# EAGLE board ext_tuner_rev1 (EAGLE 7.6.0)
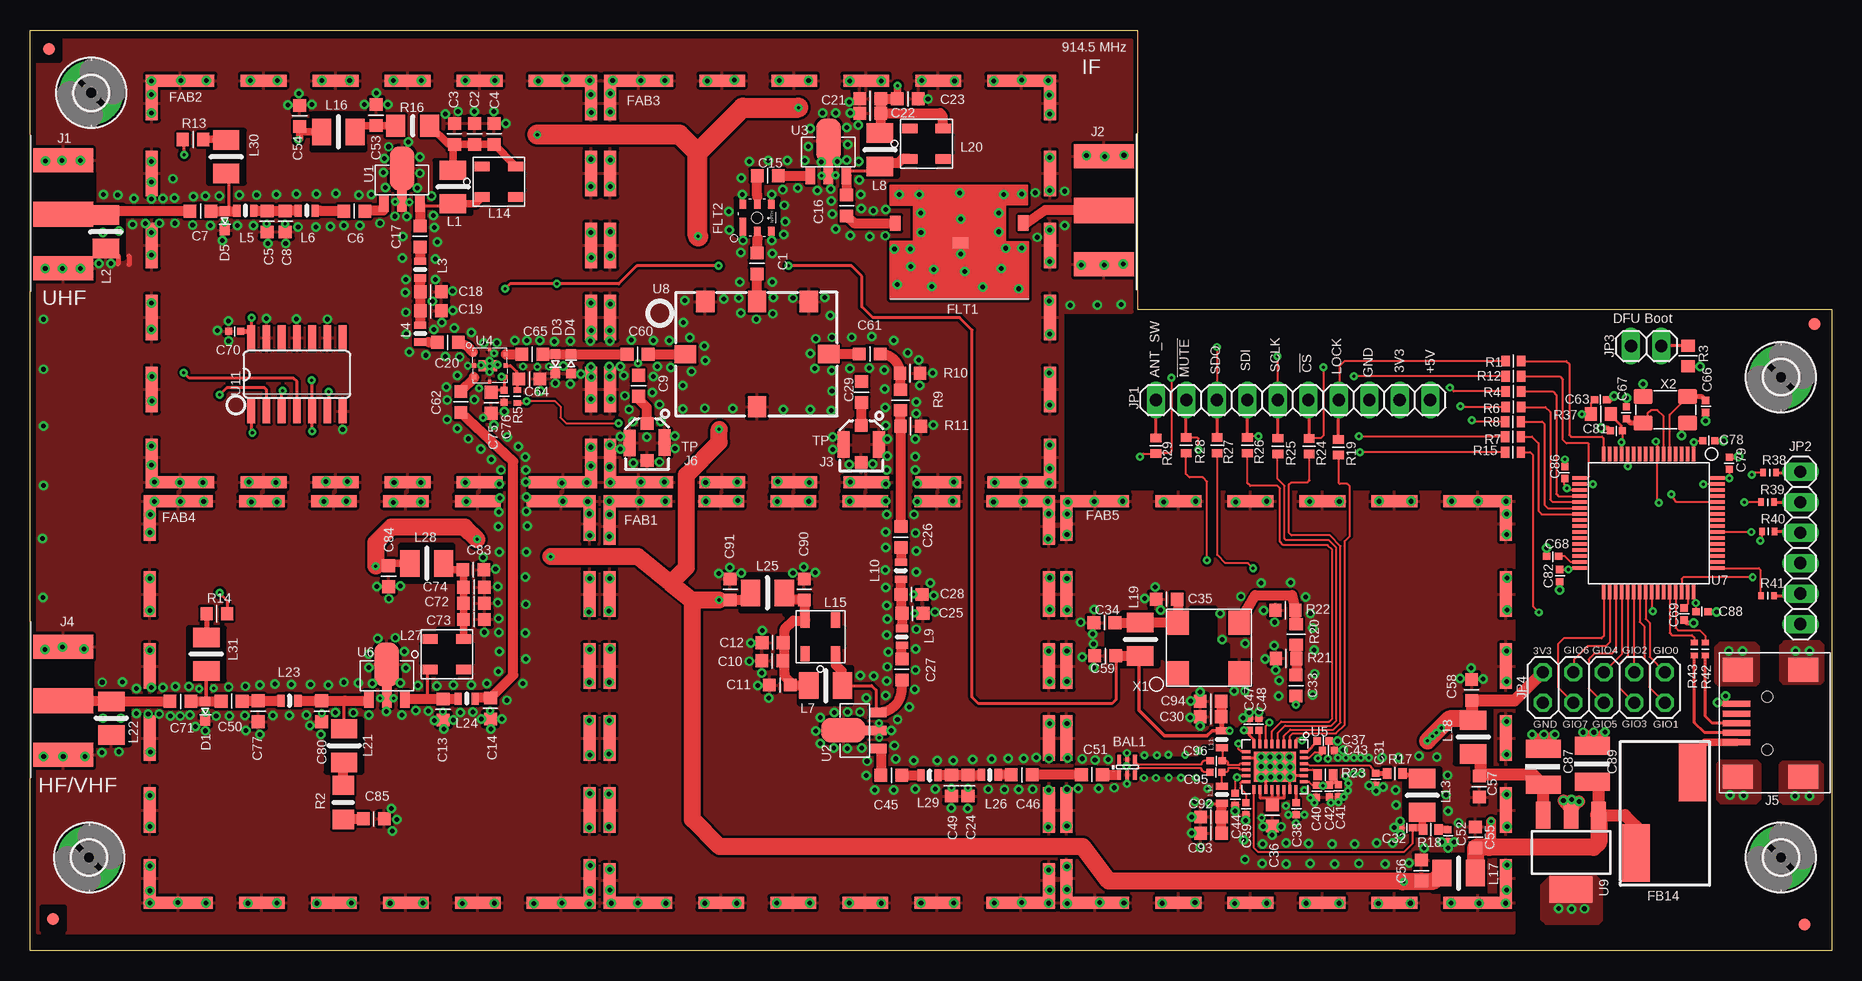
[diagram p8: board, top side]
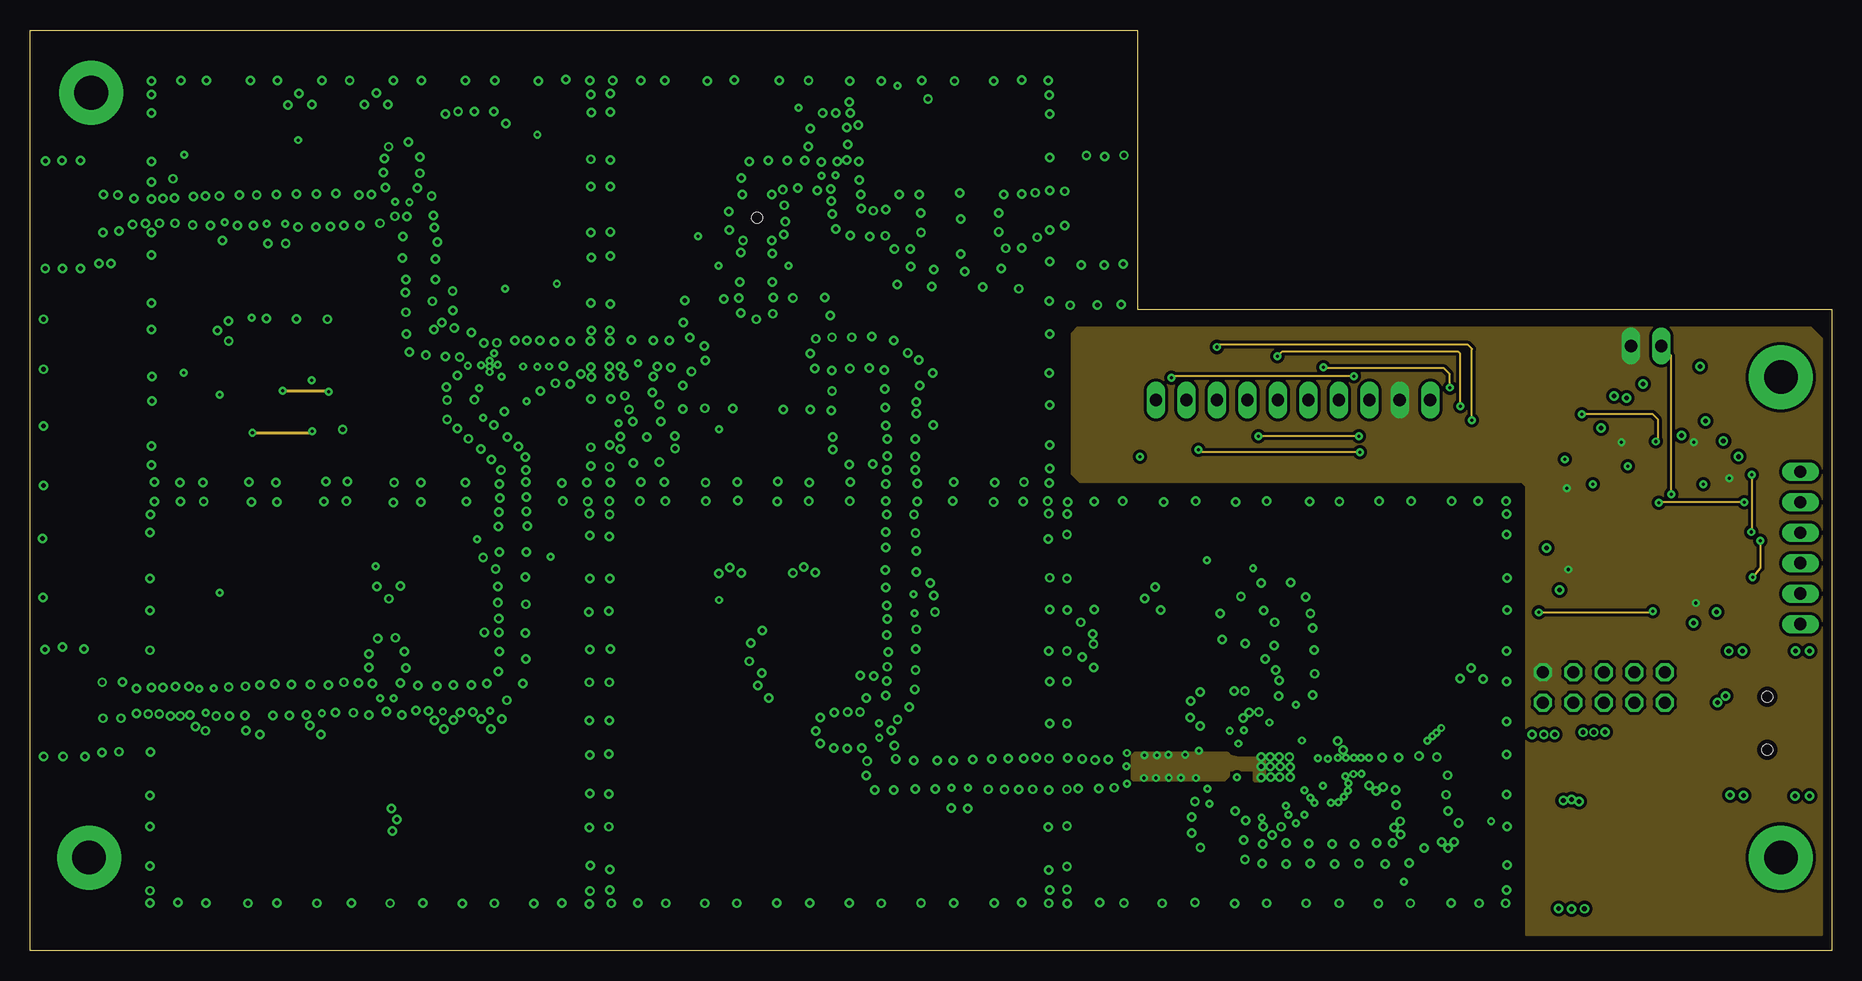
[diagram p9: board, inner layer Route2]
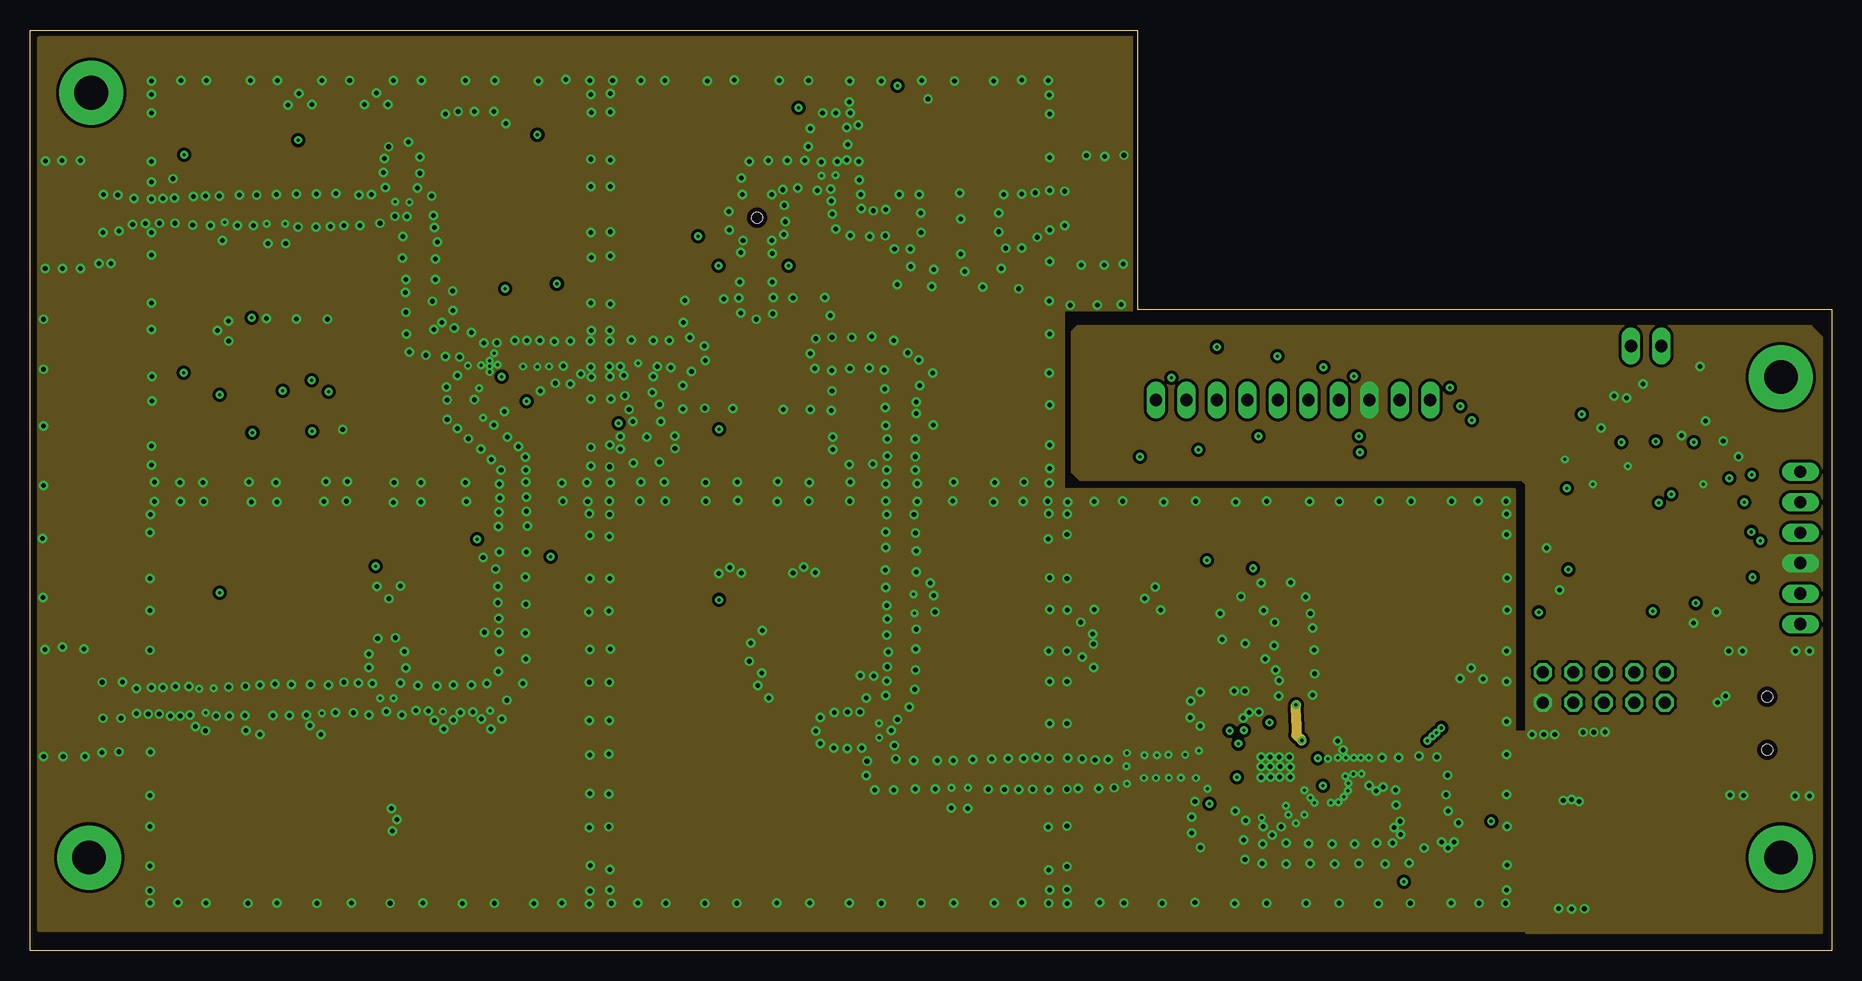
[diagram p10: board, inner layer Route3]
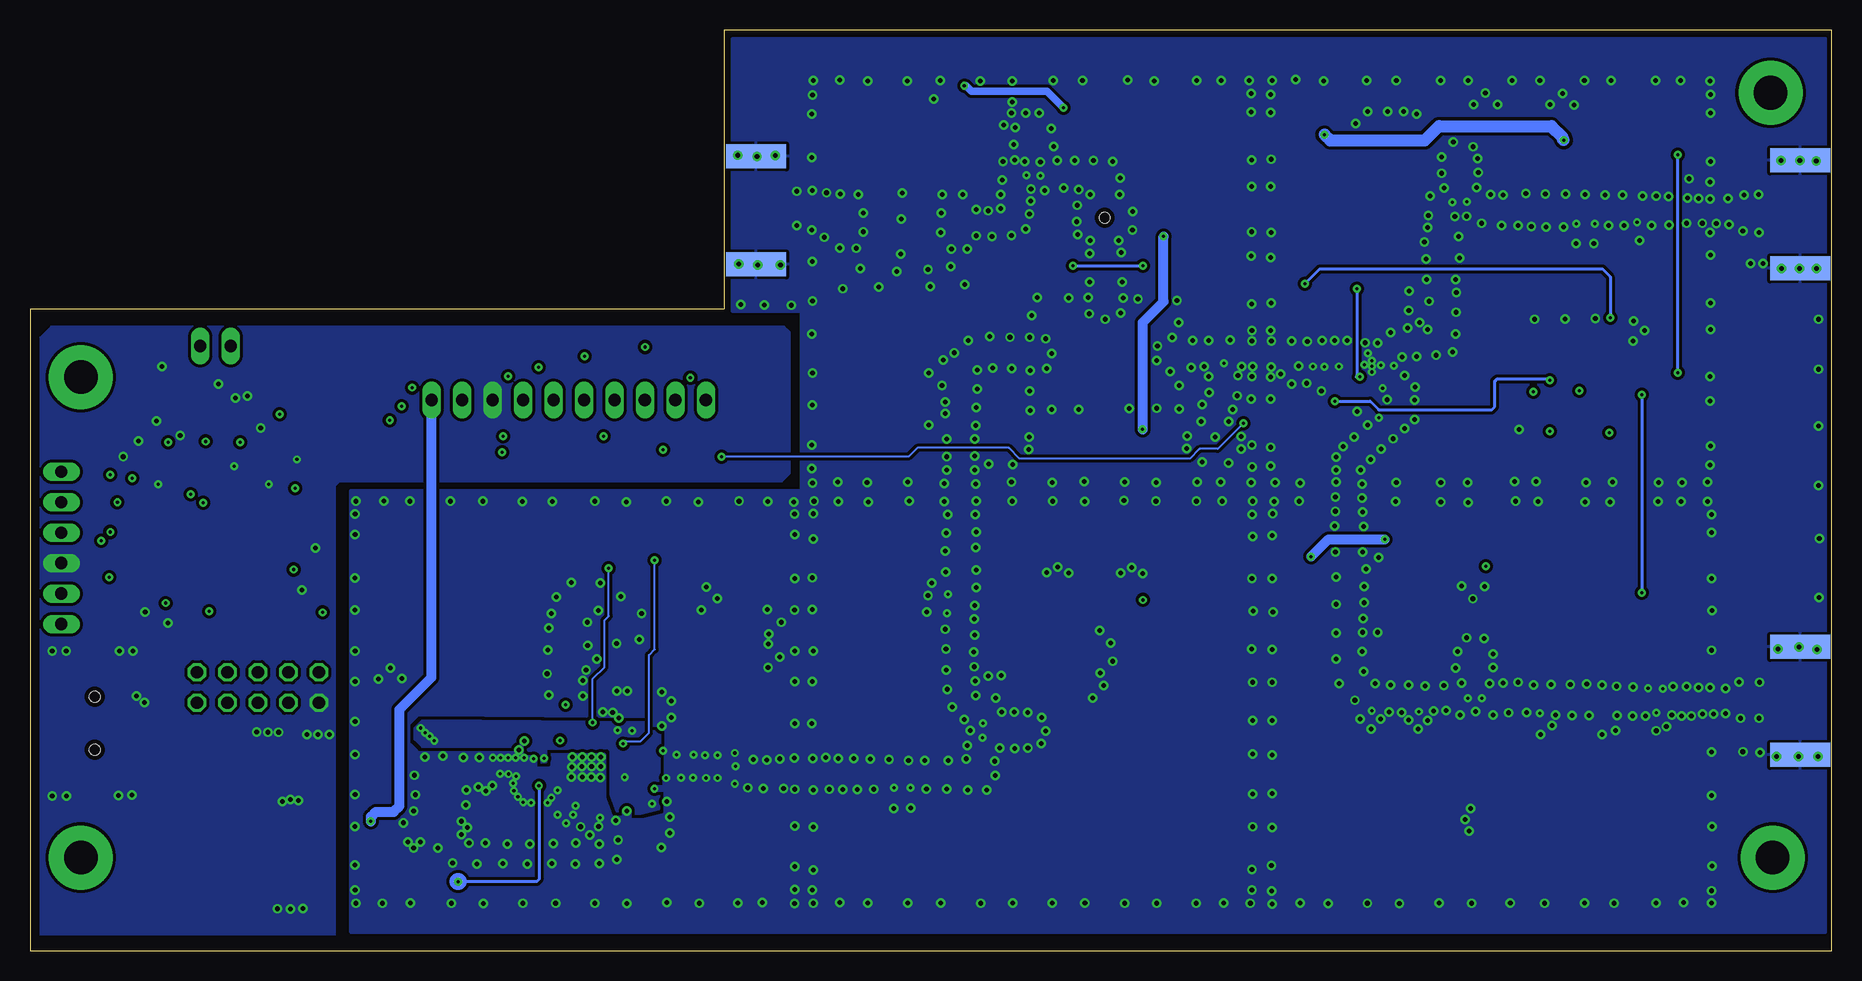
[diagram p11: board, bottom side, seen from below]

Size 150.19 x 76.73 mm. Coordinates in mm from the lower left corner, seen from the top.
Outline: 0,76.73 92.33,76.73 92.33,53.47 150.19,53.47 150.19,0 0,0 0,76.73
Copper layers (1+2+3+16): Top 0.035mm / dielectric 0.2mm / Route2 0.035mm / dielectric 0.15mm / Route3 0.035mm / dielectric 0.2mm / Bottom 0.035mm
Design rules "default *": minimum track width 6mil, minimum drill 10mil, track to track 5mil, track to pad 5mil, pad to pad 5mil, via to via 5mil, smd to smd 0mil, copper to edge 15mil, drill to drill 6mil, minimum pad ring 10mil, minimum via ring 8mil, stop-mask expansion 0mil, vias tented up to drill 50mil, thermal gap 10mil
Net classes: 1 differential: width 0.127 mm, clearance 0.127 mm
Holes 0.89 mm at 60.6,61.09
tRestrict: area 13.9,61.1 to 14.5,62.2; area 26.7,61.1 to 27.3,62.2; area 0.7,57.9 to 5.4,60.2; area 0.6,62.5 to 5.3,64.8; area 0.5,21.9 to 5.2,24.3; area 0.4,17.4 to 5.1,19.7; area 87,62.8 to 91.7,65.2; area 87,58.2 to 91.7,60.6; area 1,1.8 to 2.9,3.6; area 0.6,74.2 to 2.5,76.1; area 147.8,51.3 to 149.7,53.2; area 147,1.3 to 148.9,3.1; 75 more areas

## Footprints (pad centres in the part's own frame; a part is rotated, then mirrored left to right if it is on the bottom)
TDK_BALUN_5PIN = smd 0.3 x 0.8: 1 -0.635,-0.66; 2 0.015,-0.66; 3 0.665,-0.66; 4 0.665,0.64; 5 0.015,0.64; 6 -0.635,0.64
C0603 = smd 1.05 x 1.08: 1 -0.875,0; 2 0.875,0
C0402@1 = smd 0.6 x 0.6: 1 -0.5,0; 2 0.501,0
1210K = smd 1.5 x 2.9: A -1.5,0; C 1.5,0
SC-79_PINDIODE = smd 0.813 x 0.813: A -0.813,-0.025; C 0.787,-0.025
RF_SHIELD = smd 5.72 x 1: P$1 -15.56,-16.51; P$6 16.36,-16.51; P$7 -15.56,16.97; P$12 16.36,16.97 | smd 3.8 x 1: P$2 -8.59,-16.51; P$3 -2.59,-16.51; P$4 3.41,-16.51; P$5 9.41,-16.51; P$8 -8.59,16.97; P$9 -2.59,16.97; P$10 3.41,16.97; P$11 9.41,16.97 | smd 1 x 3.14: P$13 -17.92,-14.44; P$19 18.72,-14.44 | smd 1 x 3.8: P$14 -17.92,-8.77; P$15 -17.92,-2.77; P$16 -17.92,3.23; P$17 -17.92,9.23; P$20 18.72,-8.77; P$21 18.72,-2.77; P$22 18.72,3.23; P$23 18.72,9.23 | smd 1 x 2.8: P$18 -17.92,15.07; P$24 18.72,15.07
SMB2.5-2 = smd 4.8 x 2.3: P$1 -3.364,2.416; P$2 3.336,-2.284
FIDUCIAL = smd 1.016 x 1.016: 1 0,0
SAWMURATA914 = smd 0.889 x 1.27: 1 5.283,1.295; 2 -5.385,1.27 | smd 1.27 x 0.889: GPAD 0.051,-0.356
SM3030-6 = smd 1.5 x 0.6: 1 -0.725,1.175 | smd 0.75 x 0.6: 2 -1.1,-0.025; 3 -1.1,-1.2; 4 1.15,-1.2; 5 1.15,-0.025; 6 1.15,1.175
2,8-PAD = drill 2.8 pad 5.334: B2,8 0,0
SMA_EDGE = smd 2 x 5: GND1 0,0; GND3 9,0 | smd 2 x 5 bottom: GND2 0,0.127; GND4 9,0.127 | smd 2.1 x 5: RF 4.5,0
UFLCONNECTOR = smd 2.2 x 1: 1 0.01,-1.46; 2 -0.01,1.46 | smd 1.05 x 1.05: 3 -1.5,0; RF 1.6,0
1734035-2 = smd 2.3 x 0.5: 1 2.9,1.45; 2 2.9,0.65; 3 2.9,-0.15; 4 2.9,-0.95; 5 2.9,-1.75 | smd 2.5 x 2: 6 -2.65,-4.6; 7 -2.65,4.3; 8 2.8,-4.6; 9 2.8,4.3 | hole 0.9: 0.35,2.05; 0.35,-2.35
1X10 = drill 1.016 long: 1 -11.43,0; 2 -8.89,0; 3 -6.35,0; 4 -3.81,0; 5 -1.27,0; 6 1.27,0; 7 3.81,0; 8 6.35,0; 9 8.89,0; 10 11.43,0
1X06 = drill 1.016 long: 1 -6.35,0; 2 -3.81,0; 3 -1.27,0; 4 1.27,0; 5 3.81,0; 6 6.35,0
1X02 = drill 1.016 long: 1 -1.27,0; 2 1.27,0
2X05 = drill 1.016 octagon: 1 -5.08,-1.27; 2 -5.08,1.27; 3 -2.54,-1.27; 4 -2.54,1.27; 5 0,-1.27; 6 0,1.27; 7 2.54,-1.27; 8 2.54,1.27; 9 5.08,-1.27; 10 5.08,1.27
L3225M = smd 1.6 x 2.2: 1 -1.4,0; 2 1.4,0
MURATA_LQW_0603 = smd 0.6 x 1: 1 -0.7,0; 2 0.7,0
TCCH-80+ = smd 0.762 x 1.27: 1 -1.27,1.524; 2 1.27,1.524; 3 1.27,-1.27; 4 -1.27,-1.27
R0603_COMPACT = smd 0.7 x 0.9: 1 -0.65,0; 2 0.65,0
R1206 = smd 1.6 x 1.803: 1 -1.422,0; 2 1.422,0
R0603 = smd 1 x 1.1: 1 -0.85,0; 2 0.85,0
0402$1 = smd 0.457 x 0.61: 1 -0.548,0; 2 0.523,0
0603 = smd 1 x 1.1: 1 -0.85,0; 2 0.85,0
R0402 = smd 0.7 x 0.9: 1 -0.65,0; 2 0.65,0
SOT89 = smd 0.8 x 1.4: 1 -1.474,-2.768; 3 1.524,-2.768 | smd 0.8 x 1.9: 2 0.025,-2.514 | smd 2.032 x 3.65: 2@1 0.025,0.153
PE4245 = smd 0.355 x 0.355: 1 -0.95,-1.325; 2 0,-1.325; 3 0.95,-1.325; 4 0.95,1.325; 5 0,1.325; 6 -0.95,1.325 | smd 0.3 x 0.25: G2 1.35,0; G3 -1.35,0 | smd 0.92 x 1.54: GP 0.002,-0.175
QFN28_NONSQ = smd 0.25 x 0.7: 1 -1.75,-1.9; 2 -1.25,-1.9; 3 -0.75,-1.9; 4 -0.25,-1.9; 5 0.25,-1.9; 6 0.75,-1.9; 7 1.25,-1.9; 8 1.75,-1.9; 15 1.75,1.9; 16 1.25,1.9; 17 0.75,1.9; 18 0.25,1.9; 19 -0.25,1.9; 20 -0.75,1.9; 21 -1.25,1.9; 22 -1.75,1.9 | smd 0.7 x 0.25: 9 2.4,-1.25; 10 2.4,-0.75; 11 2.4,-0.25; 12 2.4,0.25; 13 2.4,0.75; 14 2.4,1.25; 23 -2.4,1.25; 24 -2.4,0.75; 25 -2.4,0.25; 26 -2.4,-0.25; 27 -2.4,-0.75; 28 -2.4,-1.25 | smd 3.5 x 2.5: GPAD 0,0
STM32_LQFP64 = smd 0.3 x 1.2: 1 -3.5,-5.5; 2 -3,-5.5; 3 -2.5,-5.5; 4 -2,-5.5; 5 -1.5,-5.5; 6 -1,-5.5; 7 -0.5,-5.5; 8 0,-5.5; 9 0.5,-5.5; 10 1,-5.5; 11 1.5,-5.5; 12 2,-5.5; 13 2.5,-5.5; 14 3,-5.5; 15 3.5,-5.5; 16 4,-5.5; 33 4,6; 34 3.5,6; 35 3,6; 36 2.5,6; 37 2,6; 38 1.5,6; 39 1,6; 40 0.5,6; 41 0,6; 42 -0.5,6; 43 -1,6; 44 -1.5,6; 45 -2,6; 46 -2.5,6; 47 -3,6; 48 -3.5,6 | smd 1.2 x 0.3: 17 6,-3.5; 18 6,-3; 19 6,-2.5; 20 6,-2; 21 6,-1.5; 22 6,-1; 23 6,-0.5; 24 6,0; 25 6,0.5; 26 6,1; 27 6,1.5; 28 6,2; 29 6,2.5; 30 6,3; 31 6,3.5; 32 6,4; 49 -5.5,4; 50 -5.5,3.5; 51 -5.5,3; 52 -5.5,2.5; 53 -5.5,2; 54 -5.5,1.5; 55 -5.5,1; 56 -5.5,0.5; 57 -5.5,0; 58 -5.5,-0.5; 59 -5.5,-1; 60 -5.5,-1.5; 61 -5.5,-2; 62 -5.5,-2.5; 63 -5.5,-3; 64 -5.5,-3.5
SYM-18H = smd 1.778 x 1.524: 1 5.969,0.025; 2 -5.969,0 | smd 1.524 x 1.778: 3 0,-4.369; 4 0,4.394; 5 -4.318,-4.369; 6 4.318,-4.369
SOT223 = smd 1.219 x 2.235: 1 -2.311,-3.099; 2 0,-3.099; 3 2.311,-3.099 | smd 3.6 x 2.2: 4 0,3.099
SO14 = smd 0.66 x 2.032: 1 -3.81,-3.073; 2 -2.54,-3.073; 3 -1.27,-3.073; 4 0,-3.073; 5 1.27,-3.073; 6 2.54,-3.073; 7 3.81,-3.073; 8 3.81,3.073; 9 2.54,3.073; 10 1.27,3.073; 11 0,3.073; 12 -1.27,3.073; 13 -2.54,3.073; 14 -3.81,3.073
CWX8XX_5MM_7MM = smd 1.8 x 2: 1 -2.5,-2.1; 2 2.58,-2.1; 3 2.58,2.1; 4 -2.5,2.1
ECS_CRYSTAL_ECS-250-20-30B-DU_CRYSTAL = smd 1.6 x 1.25: 1 -1.9,-1.1; 3 1.8,1.1; GND@1 -1.9,1.1; GND@2 1.8,-1.1

## Placement (x,y rotation side)
BAL1  HHM17147A1  [TDK_BALUN_5PIN]  91.44,15.32 0 top
C1  330pF  [C0603]  60.6,57.28 90 top
C2  1000pF  [C0603]  37.06,68.07 270 top
C3  330pF  [C0603]  35.38,68.07 270 top
C4  2.2uF  [C0603]  38.68,68.07 90 top
C5  2.2pF  [C0603]  19.76,60.78 270 top
C6  4.7pF  [C0603]  27.03,61.65 180 top
C7  4.7pF  [C0603]  14.22,61.65 180 top
C8  1.0pF  [C0603]  21.29,60.78 270 top
C9  DNP  [C0603]  50.72,47.09 90 top
C10  1000pF  [C0603]  61.87,24.16 0 top
C11  330pF  [C0603]  62.51,22.15 0 top
C12  2.2uF  [C0603]  61.9,25.68 180 top
C13  2.2pF  [C0603]  34.44,20.12 270 top
C14  8.2pF  [C0603]  38.38,20.19 270 top
C15  330pF  [C0603]  61.49,64.59 0 top
C16  330pF  [C0603]  68.07,62.1 90 top
C17  4.7pF  [C0603]  32.51,59.54 90 top
C18  2.2pF  [C0603]  33.4,54.91 0 top
C19  1.0pF  [C0603]  33.4,53.34 0 top
C20  4.7pF  [C0603]  34.82,50.7 180 top
C21  1000pF  [C0603]  70.03,71.02 0 top
C22  330pF  [C0603]  70.03,69.8 0 top
C23  2.2uF  [C0603]  73.18,70.99 0 top
C24  1.0pF  [C0603]  78.18,13.77 270 top
C25  1.0pF  [C0603]  73.56,28.12 0 top
C26  2.2pF  [C0603]  72.59,34.47 270 top
C27  2.2pF  [C0603]  72.67,23.44 270 top
C28  0.5pF  [C0603]  73.48,29.69 0 top
C29  DNP  [C0603]  69.32,46.56 90 top
C30  1uF  [C0603]  98.42,19.51 180 top
C31  1.5nF  [C0402@1]  112.17,14.3 270 top
C32  2.2nF  [C0402@1]  114.76,10.26 180 top
C33  1uF  [C0603]  105.54,22.1 90 top
C34  330pF  [C0603]  89.56,27.36 0 top
C35  1uF  [C0603]  94.74,29.31 180 top
C36  2.2uF  [C0603]  103.56,11.28 270 top
C37  1uF  [C0402@1]  107.8,17.48 0 top
C38  1uF  [C0402@1]  105.54,11.84 270 top
C39  1uF  [C0402@1]  101.35,11.84 270 top
C40  0.012uF  [C0402@1]  107.24,13.28 270 top
C41  0.012uF  [C0402@1]  109.07,13.34 270 top
C42  1uF  [C0402@1]  108.31,13.31 270 top
C43  0.1uF  [C0402@1]  108.23,16.69 0 top
C44  0.012uF  [C0402@1]  100.46,12.62 270 top
C45  2.2pF  [C0603]  71.81,14.63 0 top
C46  2.2pF  [C0603]  82.68,14.66 0 top
C47  0.1uF  [C0402@1]  101.63,18.87 90 top
C48  0.1uF  [C0402@1]  102.44,18.87 90 top
C49  0.5pF  [C0603]  76.81,13.77 270 top
C50  1uF  [C0603]  16.81,20.8 180 top
C51  330pF  [C0603]  88.52,14.68 0 top
C52  56nF  [C0402@1]  118.19,9.58 270 top
C53  2.2uF  [C0603]  28.85,69.65 90 top
C54  2.2uF  [C0603]  22.48,69.57 90 top
C55  2.2uF  [C0603]  120.5,9.45 90 top
C56  2.2uF  [C0603]  115.98,6.68 90 top
C57  2.2uF  [C0603]  120.8,13.69 270 top
C58  2.2uF  [C0603]  120.17,21.74 90 top
C59  2.2uF  [C0603]  89.64,24.59 180 top
C60  1uF  [C0603]  50.65,49.71 0 top
C61  1uF  [C0603]  70,49.73 0 top
C62  1000pF  [C0603]  35.92,45.75 270 top
C63  1uF  [C0402@1]  130.91,45.92 0 top
C64  330pF  [C0603]  41.63,47.65 0 top
C65  1000pF  [C0603]  41.86,49.71 180 top
C66  18pF  [C0402@1]  139.67,45.36 270 top
C67  18pF  [C0402@1]  133.07,44.83 90 top
C68  1uF  [C0402@1]  126.92,32.87 180 top
C69  1uF  [C0402@1]  137.87,28.07 270 top
C70  0.1uF  [C0402@1]  17.07,51.64 180 top
C71  1uF  [C0603]  12.55,20.78 180 top
C72  1000pF  [C0603]  37.01,28.96 180 top
C73  330pF  [C0603]  37.01,27.61 180 top
C74  2.2uF  [C0603]  37.01,30.3 0 top
C75  330pF  [C0603]  38.46,45.67 270 top
C76  0.1uF  [C0402@1]  39.52,46.2 270 top
C77  2.2pF  [C0603]  19.02,19.96 270 top
C78  0.1uF  [C0402@1]  139.93,42.49 0 top
C79  0.1uF  [C0402@1]  141.66,40.64 90 top
C80  8.2pF  [C0603]  24.31,19.96 270 top
C81  0.1uF  [C0402@1]  132.23,43.33 180 top
C82  0.1uF  [C0402@1]  127.51,31.27 270 top
C83  2.2uF  [C0603]  36.96,31.75 0 top
C84  2.2uF  [C0603]  29.9,31.22 270 top
C85  330pF  [C0603]  28.65,11 180 top
C86  0.1uF  [C0402@1]  127.94,39.85 90 top
C87  GRM32EC70J107ME15L 100uF  [1210K]  126.14,15.34 90 top
C88  0.1uF  [C0402@1]  139.37,28.24 0 top
C89  GRM32EC70J107ME15L 100uF  [1210K]  130.23,15.57 90 top
C90  2.2uF  [C0603]  64.54,30.12 90 top
C91  2.2uF  [C0603]  58.37,30.12 90 top
C92  1uF  [C0603]  98.45,11.15 180 top
C93  330pF  [C0603]  98.45,9.8 180 top
C94  330pF  [C0603]  98.42,20.8 180 top
C95  18pF  [C0402@1]  98.86,14.88 180 top
C96  18pF  [C0402@1]  98.88,15.85 180 top
D1  SMP1321-079LFSMD  [SC-79_PINDIODE]  14.63,19.96 270 top
D3  SMP1321-079LFSMD  [SC-79_PINDIODE]  43.81,48.92 270 top
D4  SMP1321-079LFSMD  [SC-79_PINDIODE]  45.09,48.92 90 top
D5  SMP1321-079LFSMD  [SC-79_PINDIODE]  16.26,60.83 270 top
FAB1  2118724  [RF_SHIELD]  67.03,20.95 180 top
FAB2  2118724  [RF_SHIELD]  28.07,55.55 0 top
FAB3  2118724  [RF_SHIELD]  66.29,55.55 0 top
FAB4  2118724  [RF_SHIELD]  27.91,20.5 0 top
FAB5  2118724  [RF_SHIELD]  104.32,20.5 0 top
FB14  SMB2.5R-2  [SMB2.5-2]  136.3,11.51 90 top
FID1  FIDUCIALSMD  [FIDUCIAL]  1.57,75.16 0 top
FID2  FIDUCIALSMD  [FIDUCIAL]  148.74,52.25 0 top
FID3  FIDUCIALSMD  [FIDUCIAL]  1.93,2.67 0 top
FID4  FIDUCIALSMD  [FIDUCIAL]  147.93,2.21 0 top
FLT1  DFCB3914MLEJAA-RF1**DE-W0  [SAWMURATA914]  77.52,59.36 0 top
FLT2  B39921B3588U410  [SM3030-6]  60.6,61.06 90 top
H1  3.2mm  [2,8-PAD]  145.95,47.8 0 top
H2  3.2mm  [2,8-PAD]  145.95,7.77 0 top
H3  3.2mm  [2,8-PAD]  5.11,71.5 0 top
H4  3.2mm  [2,8-PAD]  4.93,7.77 0 top
J1  SMA0.062  [SMA_EDGE]  2.77,56.87 90 top
J2  SMA0.062  [SMA_EDGE]  89.53,66.19 270 top
J3  AMPHENOL_A-1JB  [UFLCONNECTOR]  69.29,42.19 90 top
J4  SMA0.062  [SMA_EDGE]  2.77,16.33 90 top
J5  1734035-2  [1734035-2]  145.16,18.82 180 top
J6  AMPHENOL_A-1JB  [UFLCONNECTOR]  51.43,42.34 90 top
JP1  [1X10]  105.28,45.9 180 top
JP2  [1X06]  147.57,33.58 90 top
JP3  [1X02]  134.72,50.39 0 top
JP4  [2X05]  131.19,21.95 0 top
L1  47nH  [L3225M]  35.26,63.65 270 top
L2  120nH  [L3225M]  6.32,59.92 270 top
L3  LQW18AN17NG8ZD 17nH  [MURATA_LQW_0603]  32.51,56.77 270 top
L4  LQW18AN17NG8ZD 17nH  [MURATA_LQW_0603]  32.54,51.44 270 top
L5  LQW18AN17NG8ZD 17nH  [MURATA_LQW_0603]  17.96,61.67 0 top
L6  LQW18AN17NG8ZD 17nH  [MURATA_LQW_0603]  23.06,61.67 0 top
L7  47nH  [L3225M]  66.32,22.1 0 top
L8  47nH  [L3225M]  70.84,66.75 270 top
L9  LQW18AN10NG10D 10nH  [MURATA_LQW_0603]  72.67,26.16 90 top
L10  LQW18AN10NG10D 10nH  [MURATA_LQW_0603]  72.59,31.67 90 top
L11  LQW18AN68NJ00D 68nH  [MURATA_LQW_0603]  99.34,17.63 90 top
L12  LQW18AN68NJ00D 68nH  [MURATA_LQW_0603]  99.34,13 270 top
L13  LQW32FT100M0HL 10uH  [L3225M]  116.05,12.95 270 top
L14  TCCH-80+  [TCCH-80+]  39.22,64.08 90 top
L15  TCCH-80+  [TCCH-80+]  65.89,26.29 180 top
L16  CBC3225T4R7MR 4.7uH  [L3225M]  25.7,68.25 0 top
L17  CBC3225T4R7MR 4.7uH  [L3225M]  119.08,6.48 0 top
L18  CBC3225T4R7MR 4.7uH  [L3225M]  120.29,17.81 270 top
L19  CBC3225T4R7MR 4.7uH  [L3225M]  92.56,25.96 90 top
L20  TCCH-80+  [TCCH-80+]  74.85,67.26 90 top
L21  620nH  [L3225M]  26.19,17.09 90 top
L22  620nH  [L3225M]  6.78,19.38 90 top
L23  LQW18AN15NJ10D 15nH  [MURATA_LQW_0603]  21.64,20.83 0 top
L24  LQW18AN15NJ10D 15nH  [MURATA_LQW_0603]  36.4,21.01 0 top
L25  CBC3225T4R7MR 4.7uH  [L3225M]  61.47,29.82 0 top
L26  LQW18AN10NG10D 10nH  [MURATA_LQW_0603]  80.01,14.66 180 top
L27  TCCH-80+  [TCCH-80+]  34.87,24.71 90 top
L28  CBC3225T4R7MR 4.7uH  [L3225M]  33.07,32.28 0 top
L29  LQW18AN10NG10D 10nH  [MURATA_LQW_0603]  74.98,14.63 180 top
L30  120nH  [L3225M]  16.36,66.17 270 top
L31  620nH  [L3225M]  14.71,24.71 270 top
R1  22  [R0603_COMPACT]  123.65,49.15 180 top
R2  150  [R1206]  26.11,12.37 90 top
R3  866  [R0603]  138.2,49.58 270 top
R4  22  [R0603_COMPACT]  123.65,46.61 180 top
R5  15  [0402$1]  40.61,46.2 90 top
R6  22  [R0603_COMPACT]  123.65,45.31 180 top
R7  22  [R0603_COMPACT]  123.62,42.85 180 top
R8  22  [R0603_COMPACT]  123.62,44.09 180 top
R9  zero_ohm  [R0603]  72.57,45.9 270 top
R10  287  [R0603]  73.36,48.13 180 top
R11  287  [R0603]  73.41,43.71 180 top
R12  22  [R0603_COMPACT]  123.65,47.88 180 top
R13  287  [0603]  13.59,67.61 0 top
R14  287  [0603]  15.57,28.09 180 top
R15  22  [R0603_COMPACT]  123.62,41.55 180 top
R16  1.8  [R1206]  31.9,68.76 180 top
R17  71.5  [R0402]  113.77,14.78 0 top
R18  71.5  [R0402]  116.76,10.11 180 top
R19  22  [R0603_COMPACT]  109.07,41.96 270 top
R20  5.9  [R0603]  105.54,26.37 90 top
R21  866  [R0603]  104.7,24.36 0 top
R22  866  [R0603]  104.65,28.37 0 top
R23  15  [R0402]  107.98,14.68 0 top
R24  22  [R0603_COMPACT]  106.63,42.04 270 top
R25  22  [R0603_COMPACT]  104.01,42.06 270 top
R26  22  [R0603_COMPACT]  101.47,42.11 270 top
R27  22  [R0603_COMPACT]  98.96,42.11 270 top
R28  22  [R0603_COMPACT]  96.37,42.11 270 top
R29  22  [R0603_COMPACT]  93.85,42.09 90 top
R37  866  [0603]  130.94,44.73 0 top
R38  15  [0402$1]  145.01,39.85 0 top
R39  15  [0402$1]  144.86,37.39 0 top
R40  15  [0402$1]  144.91,34.95 0 top
R41  15  [0402$1]  144.86,29.59 0 top
R42  15  [0402$1]  139.65,25.15 270 top
R43  15  [0402$1]  138.73,25.15 270 top
U1  PG-103+  [SOT89]  30.99,65.05 0 top
U2  HMC636ST89ETR  [SOT89]  67.94,18.34 90 top
U3  HMC636ST89ETR  [SOT89]  66.52,67.36 0 top
U4  4245-52  [PE4245]  38.33,48.77 270 top
U5  LTC6948IUFD-4#PBF  [QFN28_NONSQ]  103.78,15.34 180 top
U6  PGA-103+  [SOT89]  29.72,23.72 0 top
U7  STM32_STM32F40X_LQFP64RGT6  [STM32_LQFP64]  135.18,35.89 180 top
U8  SYM-63LH+  [SYM-18H]  60.6,49.73 180 top
U9  MCP1826ST-3302E/DB  [SOT223]  128.45,8.2 180 top
U11  74ALS04D  [SO14]  22.25,48.03 0 top
X1  CWX813-100.0M_ALT_TB522-100.0M  [CWX8XX_5MM_7MM]  98.22,25.25 0 top
X2  8MHz  [ECS_CRYSTAL_ECS-250-20-30B-DU_CRYSTAL]  136.37,45.09 0 top

## Tracks (layer width: path | path; a pad name or v marks a point on that pad's centre or on a via)
3V3  (via drill 0.25 pad 0.25)
  Top 0.152: C44.1 100.46,14.3 v100.61,14.45 100.74,14.58 101.37,14.58 U5.13 | U5.27 106.64,16.09 107.11,16.56 107.6,16.56 C43.1 | U7.19 128.26,38.39 v128.09,38.56 128.02,38.66 127.91,38.86 127.91,39.33 C86.1 | U7.13 132.68,42.38 v132.66,42.39 132.73,42.46 C81.1 | U7.64 v141.65,39.39 v141.66,39.4 C79.1 | U7.1 v138.68,42.36 | v138.68,42.36 v138.68,42.37 | U7.32 128.33,31.89 v128.22,31.78 v128.21,31.77 C82.1 | U7.48 138.68,29.16 v138.86,28.98 C88.1 | v138.68,42.36 138.73,42.36 138.86,42.49 C78.1
  Top 0.254: v100,18.34 99.8,18.34 L11.2 | v98.32,12.27 99.3,12.27 L12.2 | v101.19,18.36 101.33,18.37 C47.1 101.65,18.35 101.65,17.98 102.03,17.6 U5.8 | R37.2 132.1,44.31 132.59,43.81 132.59,43.48 132.64,43.43 C81.1 | 107.6,16.56 107.59,16.3 v107.34,16.05 | C59.1 90.51,20.92 90.2,20.6 79.07,20.6 78.54,21.13 78.54,51.71 77.5,52.76 70.26,52.76 69.34,53.67 69.34,56.21 68.48,57.07 v63.25,57.07 | v57.4,57.07 50.57,57.07 49.07,55.58 v43.92,55.58 40.01,55.58 v39.6,55.17 | v18.47,52.76 18.44,52.73 U11.14 | C75.1 38.46,46.66 38.4,46.71 C76.1 39.52,47.69 U4.4 v39.32,47.83
  Top 0.305: 99.8,18.34 98.55,18.34 98.12,17.91 94.56,17.91 92.43,20.04 92.43,24.59
  Top 0.406: C70.1 18.39,51.64 18.42,51.66 18.42,51.13 U11.14 | C30.1 99.3,18.37 L11.2 | 99.29,11.94 99.29,12.25 L12.2
  Top 0.813: C93.1 C92.1 99.33,11.9 99.29,11.94 | C94.1 C30.1 | C59.1 92.43,24.59 92.53,24.59 L19.1
  Top 1.016: L18.1 120.17,19.33 C58.1 123.76,20.87 JP4.2
  Top 1.422: 120.17,19.33 118.32,19.33 v116.48,17.5
  Bottom 0.254: v63.25,57.07 v57.4,57.07 | v43.92,55.58 42.67,56.82 19.13,56.82 18.47,56.16 v18.47,52.76 | v39.6,55.17 39.6,47.87 U4.4 39.33,47.82 v39.32,47.83
  other vias: 116.89,17.88 117.25,18.19 117.63,18.57
  pour Route2 (isolate 0.254, no thermals): 87.33,51.94 148.44,51.94 149.35,51.03 149.35,1.3 124.74,1.3 124.74,38.68 124.36,39.07 87.5,39.07 86.84,39.73 86.84,51.46
  pour Bottom (isolate 0.254, no thermals): 117.5,19.18 118.14,18.54 118.14,17.65 117.47,16.99 109.22,17.04 107.9,15.75 107.19,15.75 107.19,16.87 107.16,16.89 102.21,16.89 102.11,16.99 101.8,16.69 101.8,13.06 101.22,11.46 99.42,11.4 97.76,11.84 97.69,19.02
3V3_VIN
  Top 0.813: C87.A 125.43,13.84
  Top 1.016: 120.92,14.68 125.3,14.68 C87.A U9.3 | 120.92,14.68 C57.1 | 120.92,14.68 120.92,15.78 L18.2
!MUTE  (via drill 0.25 pad 0.25)
  Top 0.152: R15.2 v110.85,41.55 | v97.41,41.76 97.41,42.67 97.31,42.77 96.38,42.77 R28.1
  Top 0.254: R28.1 96.37,45.9 96.49,46.02 96.49,46 JP1.9
  Route2 0.152: v110.85,41.55 97.61,41.55 v97.41,41.76
+5V  (via drill 0.25 pad 0.25)
  Top 0.152: U5.23 106.61,14.09 106.91,13.79 C40.1 | 108.28,13.78 107.79,13.78 v107.77,13.77
  Top 0.406: R23.2 108.63,14.28 | 108.63,14.28 108.63,14.13 C42.1 108.28,13.78 C40.1 | 108.63,14.28 C41.1
  Top 0.61: L16.1 22.92,68.25 C54.1 22.48,67.69 v22.35,67.56 | L28.1 30.09,32.28 C84.1 28.87,32.09 v28.83,32.05 | v72.31,72.09 72.31,71 C23.1 | C91.1 57.44,29.25 v57.43,29.24
  Top 0.813: C22.2 70.88,69.82 C21.2 71.82,71.02 C23.1 | C22.2 70.9,68.21 L8.1 | C22.2 75.87,69.8 76.05,69.62 76.05,68.61 L20.3 | C91.1 59.65,29.25 L25.1
  Top 1.422: L17.1 117,5.81 C56.1 115.94,5.77 v114.5,5.77 114.3,5.77 114.25,5.82 89.92,5.82 87.73,8.69 57.48,8.69 55.22,10.95 55.22,29.16 | 55.22,29.16 55.25,29.24 v57.43,29.24 | 55.22,29.16 53.39,30.64 | 53.39,30.64 50.67,32.84 v43.41,32.84 | v37.26,34.29 36.25,35.31 30.12,35.31 28.83,34.01 v28.83,32.05 | 53.39,30.64 54.71,31.96 54.71,39.65 57.45,42.39 v57.45,43.46
  Top 1.676: v55.7,59.54 55.65,59.59 55.65,66.5 | 55.65,66.5 54.13,68.02 v42.29,68.02 | 55.65,66.5 59.41,70.26 v64.06,70.26
  Bottom 0.254: v107.77,13.77 107.77,5.94 107.95,5.77 v114.5,5.77
  Bottom 0.61: v64.06,70.26 65.43,71.63 71.7,71.63 72.16,72.09 v72.31,72.09
  Bottom 0.813: v43.41,32.84 41.96,34.29 v37.26,34.29 | v57.45,43.46 57.43,43.48 57.43,52.37 55.7,54.1 v55.7,59.54
  Bottom 1.016: v42.29,68.02 41.81,67.54 33.93,67.54 32.74,68.73 23.37,68.73 22.43,67.79 22.43,67.64 v22.35,67.56
  Bottom 1.422: v114.5,5.77 114.48,5.79
+5V_VIN  (via drill 0.25 pad 0.25)
  Top 0.813: 121.64,8.61 121.64,9.02 121.79,9.17 v121.79,10.79
  Top 1.016: C89.A 130.76,13.54 U9.1 132.94,11.3 133.86,10.39 133.86,8.16 FB14.P$1
  Top 1.422: U9.1 130.76,9.02 130.35,8.61 121.64,8.61 120.53,8.61 C55.1 120.5,6.5 L17.2
  Bottom 0.813: v121.79,10.79 121.77,10.82 121.77,11.18 121.36,11.58 119.86,11.58 119.38,12.06 119.38,20.12 116.71,22.78 JP1.1
ANT_SW  (via drill 0.25, 0.25 pad 0.25)
  Top 0.152: R12.2 v110.34,47.88 | v95.15,47.75 95.15,41.63 94.97,41.45 93.87,41.45 R29.1 92.8,41.44 v92.53,41.17 | v41.4,45.8 41.43,45.82 43.74,45.82 44.22,45.34 44.22,44.42 44.68,43.97 v49.05,43.97
  Top 0.254: U11.1 18.44,43.26 v18.54,43.15 | v23.52,43.28 U11.5 23.5,44.98 v23.5,47.55 | R5.1 41.26,45.65 v41.4,45.8
  Route2 0.152: v110.34,47.88 95.28,47.88 v95.15,47.75
  Route2 0.254: v18.54,43.15 23.39,43.15 v23.52,43.28
  Bottom 0.152: v49.05,43.97 51.18,41.83 52.71,41.83 53.52,41.02 67.72,41.02 68.61,41.91 76.23,41.91 76.96,41.17 v92.53,41.17
  Bottom 0.254: v41.4,45.8 38.48,45.8 37.77,45.08 28.35,45.08 28.09,45.34 28.09,47.47 27.91,47.65 23.6,47.65 v23.5,47.55
BALUN_N
  Top 0.152: C96.2 97.98,15.85 arc90 97.64,15.51 92.55,15.51 arc-90 BAL1.4
BALUN_P
  Top 0.152: C95.2 97.98,14.88 arc-90 97.64,15.23 92.42,15.23 arc90 92.13,14.94 92.13,14.68 arc-90 BAL1.3
BOOT0  (via drill 0.25 pad 0.25)
  Top 0.152: U7.60 137.23,37.39 v136.8,38.05
  Top 0.254: R3.1 136.03,50.43 JP3.2
  Route2 0.152: v136.8,38.05 136.8,49.58 JP3.2
FS_DM
  Top 0.254: J5.2 139.59,18.17 138.73,19.02 R43.2
FS_DP
  Top 0.254: J5.3 140.21,18.97 139.65,19.53 R42.2
GIO0
  Top 0.152: U7.40 134.68,27.65 135,27.33 135,24.49 JP4.10
GIO1
  Top 0.152: U7.39 134.18,27.42 134.57,27.03 134.57,24.33 134.98,23.93 134.98,21.97 JP4.9
GIO2
  Top 0.152: U7.38 133.68,23.27 JP4.8
GIO3
  Top 0.152: U7.37 133.18,24.59 132.49,23.9 132.49,21.92 JP4.7
GIO4
  Top 0.152: U7.36 132.68,24.7 JP4.6
GIO5
  Top 0.152: U7.35 132.18,25.09 131.85,24.76 130.38,24.76 130.05,24.43 130.05,24.41 129.92,24.28 129.92,21.87 131.29,20.5 131.29,20.57 JP4.5
GIO6
  Top 0.152: U7.34 131.68,25.71 131.34,25.37 129.82,25.37 128.7,24.26 128.7,23.27 JP4.4
GIO7
  Top 0.152: U7.33 131.18,26.23 130.99,26.03 127.84,26.03 127.36,25.55 127.36,21.97 JP4.3
GND  (via drill 0.25, 0.25 pad 0.25, 0.38)
  Top 0.152: U7.18 130.03,38.89 v130.28,38.89 | U7.12 133.18,41.07 v133.17,40.39 | U7.63 139.98,38.89 v139.5,38.89 | C86.2 v127.94,40.94
  Top 0.254: R3.2 139.15,48.73 v139.19,48.69 | J2.GND1 90.35,67.08 | U11.11 22.23,51.13 | U5.24 105.05,14.59 v105.05,14.48 105.03,14.46 U5.21 | U5.17 103.03,14.11 v103.4,14.48 | U5.10 102.55,16.09 v102.62,16.15
  Top 0.305: X2.GND@2 137.67,43.48 v137.67,42.95 | C66.2 139.65,44.84 v139.65,44.15 | X2.GND@1 v134.47,47.24 | C67.2 v133.07,46.08
  Top 0.406: 7.34,57.93 7.34,57.25 | 8.26,57.88 8.26,57.18 | C78.2 v141.15,42.49 | C79.2 141.69,41.17 v142.42,41.17 | C88.2 v140.59,28.24 | C69.2 138.11,27.33 v138.68,27.33 | C82.2 v127.51,30.07 | C68.2 v126.42,33.58 | C63.2 131.75,45.92 v132.05,46.23 | C81.2 131.5,43.56 v130.96,43.56 | J5.5 141.4,20.57 | 141.4,20.57 140.79,20.57 v140.67,20.7 | 141.4,20.57 141.4,21.16 141.3,21.26 | v59.44,59.18 59.43,59.18 FLT2.1 | FLT2.6 59.36,62.21 v59.36,63.02 | FLT2.4 61.82,62.21 v61.82,63.04 | FLT2.3 61.82,59.96 v61.82,59.18
  Top 0.813: 126.14,17.09 126.11,17.12 | 126.11,17.12 v125.22,18.01 | 126.11,17.12 126.11,17.93 126.21,18.03 | C87.C 126.14,17.09 | 126.14,17.09 127.08,18.03 | C89.C 130.23,18.08 v130.35,18.21 | C89.C 130.23,17.45 v129.46,18.21 | C89.C 130.23,17.17 v131.29,18.24
  Top 1.016: U9.2 128.45,11.71 128.42,11.73 | 128.42,11.73 v127.81,12.52 | 128.42,11.73 128.47,12.52 | v129.13,12.45 128.8,12.22 128.4,11.48
  Bottom 0.152: v2.72,25.32 J4.GND4 | J4.GND2 v2.77,16.18 | J1.GND4 2.66,65.87 v2.67,65.86 | J1.GND2 v2.69,56.87 | J2.GND4 v89.54,57.15
  Bottom 0.254: J2.GND2 v89.59,66.19
  other vias: 1.27,56.87 4.19,56.87 1.3,65.81 4.22,65.86 5.74,57.28 6.76,57.28 10.11,65.76 10.13,64.06 10.13,59.87 10.11,57.99 10.11,53.98 10.11,51.77 10.16,47.85 10.16,45.82 10.11,42.06 10.13,40.49 10.36,39.07 12.5,39.01 14.43,39.04 18.26,39.07 20.5,39.04 20.57,37.41 18.47,37.39 14.48,37.44 12.55,37.44 10.36,37.44 10.03,36.35 10.01,34.85 24.66,39.12 26.44,39.09 24.49,37.44 26.37,37.46 30.35,39.04 32.59,39.04 30.3,37.36 32.59,37.39 36.3,39.01 39.14,38.91 36.37,37.44 39.17,37.72 41.33,39.07 44.32,38.99 46.41,39.01 46.48,37.44 44.4,37.46 41.38,37.82 46.76,40.39 46.76,41.96 48.34,42.14 48.31,40.34 53.75,42.9 53.77,41.86 49.23,42.88 49.23,41.83 50.29,40.67 46.79,47.83 46.76,45.97 48.34,47.85 48.41,45.97 48.36,53.9 48.34,51.69 46.74,54 46.79,51.69 46.74,59.87 46.79,57.78 48.36,59.92 48.39,57.89 46.74,65.96 46.76,63.7 48.36,63.68 48.36,65.91 48.39,71.42 48.39,69.9 46.79,69.88 46.76,71.35 46.66,72.54 44.68,72.59 42.37,72.49 48.56,72.54 50.9,72.54 52.93,72.54 38.76,72.52 36.3,72.54 32.61,72.54 30.3,72.52 26.64,72.54 24.33,72.54 20.62,72.54 18.39,72.54 14.71,72.54 12.6,72.54 10.13,72.49 10.11,71.37 10.11,69.8 56.46,72.49 58.7,72.57 62.46,72.52 64.9,72.52 68.33,72.49 70.97,72.49 74.32,72.54 77.06,72.49 80.34,72.49 82.68,72.57 84.89,72.52 84.96,71.32 85.01,69.72 85.01,66.09 84.99,63.37 85.01,60.07 84.99,57.45 84.96,54.15 85.01,51.41 84.96,48.13 84.99,45.47 85.01,42.16 85.01,40.21 84.96,38.99 82.85,39.07 80.42,39.04 77.01,39.07 73.96,38.94 84.84,37.46 82.8,37.44 80.31,37.39 76.91,37.49 73.96,37.44 71.35,38.91 68.38,39.07 68.33,37.46 71.32,37.49 64.97,39.04 64.92,37.46 62.28,37.44 62.33,39.09 58.95,39.07 59,37.52 56.34,37.46 56.31,39.01 52.88,39.07 50.93,39.07 48.39,39.01 48.29,37.46 50.83,37.46 52.96,37.46 48.31,36.37 48.29,34.52 46.66,34.59 46.61,36.42 10.01,31.01 9.98,28.37 10.01,25.04 10.13,21.95 1.24,25.1 4.5,25.15 1.14,16.18 4.6,16.21 10.03,16.56 10.01,12.95 9.98,10.36 9.98,7.06 10.01,5 10.01,3.99 12.34,4.01 14.66,3.99 18.16,3.96 20.6,3.99 23.93,3.96 26.8,3.99 30.02,3.96 32.74,3.99 36.04,3.94 38.71,3.96 41.99,3.94 44.32,3.99 46.63,3.91 48.46,3.96 50.67,3.99 52.98,3.96 48.34,5.08 48.34,6.78 46.71,7.11 46.69,4.98 46.66,31.01 48.34,31.01 48.23,28.32 46.58,28.24 46.66,25.1 48.36,25.15 48.29,22.38 46.63,22.38 46.63,19.2 48.29,19.2 48.26,16.41 46.66,16.33 48.26,13.08 48.26,10.34 46.63,10.29 46.66,13.11 56.26,3.96 58.93,3.96 62.26,3.99 65,3.99 68.28,3.99 70.94,3.96 74.27,3.99 77.01,3.99 80.37,3.99 82.68,4.01 84.91,3.96 84.99,5.05 84.91,6.73 86.44,7.04 86.44,5.11 86.46,3.94 89.15,4.01 91.19,3.99 84.91,36.42 84.89,34.32 84.99,31.09 84.99,28.45 84.91,24.99 84.99,22.43 85.01,18.95 84.94,16.03 84.91,13.41 84.89,10.31 86.44,31.04 86.46,28.4 86.44,24.99 86.44,22.43 86.44,18.95 86.49,16.05 86.44,13.46 86.44,10.41 86.44,34.7 86.46,36.4 86.51,37.41 88.7,37.44 91.08,37.46 94.49,37.41 97.16,37.46 100.48,37.41 103.1,37.46 106.65,37.44 109.14,37.44 112.45,37.46 115.14,37.46 118.52,37.46 120.7,37.49 123.04,37.46 123.09,36.4 123.09,34.7 123.11,31.06 123.11,28.4 123.09,24.97 123.09,22.45 123.09,19.1 123.09,16.36 123.09,13.03 123.11,10.36 123.11,7.14 123.09,5.08 123.01,3.96 120.8,3.96 118.47,3.99 115.06,3.96 112.39,3.94 109.12,3.96 106.38,3.96 103.1,3.96 100.43,3.94 97.1,4.01 94.39,3.96 88.06,66.27 91.19,66.29 91.11,57.23 87.63,57.15 6.12,63.04 7.32,62.99 8.66,62.69 10.13,62.64 11.1,62.69 9.63,60.6 10.8,60.63 11.91,64.34 13.61,62.87 13.56,60.48 12.04,62.74 12.09,60.63 6.07,59.87 7.42,59.99 8.56,60.53 14.63,62.92 15.77,62.92 15.04,60.45 19.84,58.95 21.31,58.93 26.16,60.43 27.41,62.97 28.45,63.04 29.62,63.6 30.43,61.21 29.18,60.63 27.51,60.45 32.31,63.58 31.42,61.19 33.48,62.92 33.63,61.29 22.43,71.42 28.88,71.5 27.86,70.54 29.85,70.51 23.5,70.51 21.49,70.49 35.69,69.95 37.03,69.93 38.68,69.93 39.67,68.94 34.62,69.75 33.78,55.93 35.23,54.97 35.26,53.37 34.34,52.35 51.41,42.8 50.27,44.09 52.58,44.09 52.48,45.52 51.89,46.51 49.58,46.25 49.94,45.11 51.94,47.85 49.5,47.93 29.9,67.01 31.55,67.41 6.07,19.38 7.59,19.38 6.02,22.38 7.72,22.4 5.99,16.51 7.42,16.59 24.26,18.03 30.12,11.86 30.58,10.95 30.23,9.98 24.87,22.15 26.16,22.38 27.38,22.33 28.52,22.28 29.69,19.94 28.24,19.66 30.86,22.3 32.33,22.1 33.91,22.07 30.99,19.63 32.16,20.02 28.93,30.35 29.92,29.34 30.86,30.4 38.81,31.83 38.99,30.35 39.07,27.69 37.87,26.54 37.77,32.77 39.09,26.54 38.99,29.01 39.12,33.22 39.04,35.36 39.09,36.58 39.27,40.06 41.3,26.47 41.33,28.88 41.3,31.17 41.38,33.25 41.45,35.41 41.38,36.63 41.33,40.08 43.79,47.29 45.03,47.22 45.92,48.08 43.71,50.77 45.03,50.8 33.55,54.13 33.96,59.05 33.71,60.27 31.09,59.54 31.04,57.73 46.74,48.67 44.45,48.72 48.29,48.69 49.2,48.69 52.3,48.69 46.71,50.83 48.34,50.83 50.14,50.9 51.94,50.88 53.29,50.88 53.42,48.62 50.67,48.97 54.99,51.1 56.21,50.39 56.29,49.2 55.14,48.26 72.44,63.02 74.14,63.02 74.24,61.49 74.27,59.84 73.38,58.5 72.06,58.47 82.65,63.07 81.15,63.04 80.75,61.49 80.75,59.92 81.33,58.55 82.68,58.57 77.5,63.14 77.57,60.99 77.6,58.06 75.34,56.77 72.29,55.52 73.43,57.02 75.16,55.37 77.93,56.59 79.43,55.32 80.98,56.87 82.42,55.17 86.26,63.3 86.26,60.43 83.97,59.46 83.79,63.17 59.08,54.41 59.26,53.14 60.55,52.63 61.9,53.09 61.98,54.43 66.85,51.13 65.51,51 65.02,49.78 65.43,48.54 66.83,48.36 54.46,52.37 54.58,54.2 57.84,54.31 63.6,54.41 66.24,54.46 66.7,52.96 66.85,46.66 66.8,45.03 65.02,45.11 62.79,45.11 58.57,45.19 56.26,45.21 54.41,45.14 54.41,47.12 61.87,58.12 61.87,55.73 59.16,55.73 59.23,58.19 59.31,64.39 59.94,65.79 61.54,65.86 63.12,65.86 64.57,65.86 65.96,65.74 67.28,65.76 66.75,63.47 65.61,63.37 64.01,63.55 62.76,63.42 30.43,62.41 31.62,62.38 29.18,21.03 30.33,21.03 65.96,64.59 67.13,64.62 68.3,70.74 68.38,69.82 69.04,68.83 74.85,70.99 32.51,66.14 29.54,66.04 28.24,24.74 28.98,26.01 30.45,26.09 31.19,24.94 31.34,23.57 28.24,23.6 32.51,64.8 29.46,64.85 68.1,65.89 69.14,64.24 69.27,63.04 69.29,61.85 70.31,61.67 71.32,61.77 71.3,59.59 70,59.54 68.38,59.61 67.18,60.15 66.88,61.39 66.78,62.48 69.09,65.79 62.89,62.13 62.94,60.76 62.84,59.69 58.29,60.07 58.27,61.6 68.5,51.13 70.18,51.18 71.98,50.85 73.15,49.83 74.07,49.23 75.26,48.13 74.17,47.09 73.89,45.75 73.89,44.78 75.29,43.81 73.79,42.65 73.79,41.17 73.79,40.08 71.42,40.06 71.45,41.25 71.45,42.65 71.35,43.79 71.3,45.26 71.25,46.81 71.22,48.39 69.95,48.56 68.35,48.51 71.4,36.37 73.69,36.37 73.81,34.82 73.89,33.3 75.03,30.63 75.34,29.59 75.44,28.22 71.32,34.9 71.35,33.6 71.32,30.28 71.42,28.78 69.22,22.94 69.7,21.06 65.05,68.53 66.07,69.8 67.18,69.8 68.07,68.61 64.87,67.03 68.17,67.21 91.44,16.48 91.39,15.37 91.44,13.92 1.12,52.63 1.12,48.46 1.12,43.74 1.12,38.79 1.04,34.34 1.07,29.44 86.72,53.8 88.98,53.82 90.96,53.85 66.9,42.8 66.93,41.78 70.26,40.56 68.28,40.54 52.48,40.72 102.62,15.34 102.64,14.45 104.17,14.48 103.38,15.34 104.19,15.34 105.03,15.32 104.98,16.15 104.14,16.15 103.38,16.15 59.94,24.13 60.99,23.16 61.59,21.06 60.68,22.1 60.1,25.65 61.04,26.7 57.43,31.45 58.34,31.95 59.28,31.47 63.6,31.5 64.52,31.98 65.46,31.52 67.03,19.86 65.86,19.46 65.51,18.31 65.89,17.27 67.01,16.92 68.12,16.87 68.15,19.91 71.81,18.36 70.76,18.97 70.79,17.75 69.19,19.91 69.34,16.89 81.53,16.03 82.83,16.03 76.78,11.91 78.18,11.86 82.42,13.44 83.57,13.46 83.87,16.1 87.71,16 88.77,15.9 89.89,15.93 90.37,13.59 89.08,13.51 87.38,13.51 19.74,60.6 21.29,60.6 73.66,29.72 73.74,28.12 76.81,13.59 78.18,13.59 16.03,59.21 16.54,52.48 15.62,51.69 16.56,50.8 15.32,21.89 14.1,21.84 8.86,21.87 8.86,19.76 9.86,19.74 11.1,21.95 13.23,22.02 11.71,19.56 13.34,19.63 13.79,18.69 14.63,18.34 15.52,19.56 16.61,19.58 17.91,19.61 18.01,18.36 19.15,18.03 14.63,19.84 16.23,60.71 16.56,21.97 17.96,22.05 19.15,22.15 24.33,19.79 26.06,43.46 97.54,21.56 96.75,20.83 96.72,19.46 88.72,28.45 87.58,27.38 88.6,26.42 88.65,25.55 87.71,24.49 88.67,23.6 101.27,21.67 103.73,27.38 103.71,25.45 102.95,24.33 103.84,23.39 93.8,30.3 92.91,29.36 94.23,28.4 101.3,25.6 99.39,25.96 99.21,28.12 100.94,29.54 106.93,26.9 107.04,25.07 107.09,23.09 106.93,21.31 97.54,18.75 17.45,62.99 18.9,62.99 20.55,63.04 22.2,63.07 23.88,63.07 25.5,63.09 17.3,60.43 18.62,60.43 22.35,60.3 23.83,60.3 25.04,60.38 33.68,51.79 32.99,49.63 31.62,49.91 31.37,51.38 31.32,53.21 31.29,54.86 31.34,55.93 10.77,19.74 20.24,19.61 21.64,19.61 23.04,19.66 23.39,22.17 21.79,22.2 20.42,22.22 12.12,22.02 12.52,19.58 73.89,26.8 71.48,27.64 73.86,31.57 71.3,31.75 76.96,15.88 78.59,15.95 80.16,15.98 81.23,13.44 79.86,13.46 75.46,13.49 75.62,15.88 73.66,15.88 72.16,16 72.06,17.09 73.79,13.49 72.01,13.39 70.43,13.41 69.72,14.61 69.77,15.8 26.95,19.84 25.45,19.86 23.32,18.77 102.79,10.36 103.53,9.65 104.29,10.34 97.1,12.45 96.85,11.15 96.85,9.8 97.56,8.61 100.46,11.63 101.35,10.85 101.63,19.86 102.44,19.89 101.12,19.41 100.38,21.67 104.09,21.23 104.11,22.53 102.82,28.37 102.64,30.63 105.08,30.68 106.32,29.49 106.73,28.12 108.99,17.48 109.45,16.74 71.42,26.31 71.35,21.26 72.31,19.28 73.3,20.32 73.74,21.79 73.81,23.39 73.84,25.15 71.53,24.92 71.48,23.67 71.4,22.48 70.33,22.91 41.33,24.33 41.07,22.28 39.75,20.88 39.32,19.3 38.4,18.49 37.62,19.3 35.28,19.23 34.49,18.49 33.71,19.2 34.42,19.94 38.35,20.02 36.91,19.89 35.86,19.86 33.2,19.99 35.28,22.15 36.78,22.15 38.07,22.28 39.04,23.27 39.14,24.94 92.86,14.4 93.85,14.4 94.92,14.43 95.94,14.43 97.18,14.4 97.43,16.66 96.29,16.33 94.89,16.33 93.93,16.31 92.89,16.28 98.15,13.51 106.73,12.75 107.06,12.34 108.43,12.34 109.07,12.37 109.52,12.85 108.2,16 109.02,16.1 109.7,16.08 110.34,16.08 110.95,16.08 111.61,16.08 109.86,13.34 109.91,13.97 109.65,14.53 110.31,14.73 111,14.76 118.21,8.56 118.69,9.07 117.65,9.07 114.25,9.7 113.72,10.29 114.22,10.79 112.19,13.31 112.8,13.67 111.63,13.77 102.67,11.1 102.74,8.89 104.7,8.97 106.58,8.94 108.53,8.92 110.41,8.92 112.24,8.97 113.59,8.99 113.82,13.41 113.87,12.17 112.73,16.1 114.07,16.1 115.77,16.23 117.27,16.15 118.16,14.63 118.06,13 118.21,11.66 119.08,10.67 116.2,8.56 114.96,7.32 112.95,7.24 110.77,7.26 108.74,7.24 106.71,7.29 104.72,7.24 102.72,7.26 101.27,7.59 101.17,9.25 141.71,12.98 142.82,12.95 147.14,12.9 148.34,12.9 148.34,24.97 147.17,24.99 142.75,24.97 141.6,24.99 141.33,21.23 126.19,18.03 127.1,18.03 128.5,12.6 127.43,3.53 128.5,3.48 129.57,3.51 120.14,23.57 121.13,22.66 119.2,22.68 33.81,57.63 106.22,11.33 105.51,10.64 104.9,11.33 106.22,13.39 104.7,12.09 19.71,52.7 22.23,52.65 24.79,52.63 36.5,48.74 38.33,49.17 38.33,48.23 38.68,49.78 38.33,48.72 41.1,48.69 42.29,48.67 43.26,48.69 42.49,50.85 41.43,50.88 34.62,49.53 35.81,49.48 35.36,51.92 36.78,51.51 37.85,50.65 38.91,50.67 40.41,50.85 42.54,46.66 38.68,43.81 39.55,44.96 35.61,47.93 34.72,46.99 34.77,45.9 34.77,44.27 35.61,43.54 36.55,42.67 37.57,41.81 38.46,40.94 37.06,45.92 37.44,46.89 37.77,44.42 39.8,42.82 40.72,42.01 41.3,41.15 37.59,48.79 38.96,48.84
  pour Route3 (isolate 0.254): 0.74,76.12 91.92,76.12 91.92,53.39 86.16,53.39 86.16,38.46 123.75,38.46 123.75,18.26 126.47,18.26 126.57,18.16 126.57,2.44 125.81,1.65 0.74,1.65
  pour Top (isolate 0.203): 0.66,75.92 91.85,75.92 91.85,53.19 86.08,53.19 86.08,38.25 123.67,38.25 123.67,1.45 0.66,1.45
  pour Route2 (isolate 0.254, rank 2, no thermals): 99.95,16.26 100.08,16.26 100.81,16.1 102.69,16.1 102.95,15.85 102.95,14.43 102.67,14.15 102.11,14.15 102.03,14.22 102.03,14.96 101.96,15.04 99.95,15.04 99.87,15.11 99.87,16.18
  pour Route2 (isolate 0.254, no thermals): 92.38,16.54 99.8,16.54 99.95,16.38 99.95,14.55 99.69,14.3 99.57,14.17 91.97,14.17 91.85,14.3 91.85,16.28 92.1,16.54
  pour Route3 (isolate 0.254, no thermals): 87.33,52.1 148.44,52.1 149.35,51.18 149.35,1.45 124.74,1.45 124.74,38.84 124.36,39.22 87.5,39.22 86.84,39.88 86.84,51.61
  pour Top (isolate 0.254, no thermals): 140.89,25.65 143.76,25.65 144.04,25.37 144.04,22.35 143.81,22.12 140.79,22.12 140.54,22.38 140.54,25.3 140.84,25.6
  pour Top (isolate 0.254, no thermals): 146.28,25.78 149.15,25.78 149.43,25.5 149.43,22.48 149.2,22.25 146.18,22.25 145.92,22.5 145.92,25.43 146.23,25.73
  pour Top (isolate 0.254, no thermals): 149.05,12.24 146.18,12.24 145.9,12.52 145.9,15.54 146.13,15.77 149.15,15.77 149.4,15.52 149.4,12.6 149.1,12.29
  pour Top (isolate 0.254, no thermals): 143.84,12.29 140.97,12.29 140.69,12.57 140.69,15.6 140.92,15.82 143.94,15.82 144.2,15.57 144.2,12.65 143.89,12.34
  pour Top (isolate 0.254, no thermals): 126.85,6.35 130.38,6.35 130.96,5.77 130.96,2.49 130.71,2.24 126.39,2.24 126.03,2.59 126.03,5.51 126.85,6.32
  pour Bottom (isolate 0.254, rank 2): 0.48,76.02 91.67,76.02 91.67,53.29 85.9,53.29 85.9,38.35 123.49,38.35 123.49,1.55 0.48,1.55
  pour Bottom (isolate 0.254, no thermals): 87.33,52.02 148.44,52.02 149.35,51.1 149.35,1.37 124.74,1.37 124.74,38.76 124.36,39.14 87.5,39.14 86.84,39.8 86.84,51.54
N$1
  Top 0.813: C15.2 | C15.2 U3.1
N$2
  Top 0.254: U1.3 32.69,62.1 35.28,62.1 35.26,62.13 L1.2
  Top 0.61: L14.1 37.13,62.25 L1.2
  Top 0.813: U1.3 | U1.3 C17.2
N$3
  Top 0.406: 60.66,59.41 60.63,59.44 FLT2.2
  Top 0.813: C1.2 60.66,58.2 60.66,59.41
N$4
  Top 0.813: U4.3 37,47.71 C62.1
N$5
  Top 0.813: C16.1 68.67,60.63 FLT1.2
N$6
  Top 0.813: C6.1 27.95,61.7 29.44,61.7 29.51,61.77 U1.1
N$7
  Top 0.813: J6.RF 51.44,45.26 50.72,45.97 C9.1
N$8
  Top 0.254: 16.59,61.95 16.59,64.54 L30.2
  Top 0.406: 17.02,61.65 17.23,61.65 L5.1 | D5.A 16.28,61.65 16.59,61.95
  Top 0.813: C7.1 D5.A 17.02,61.65
N$9
  Top 0.406: 80.95,14.68 80.74,14.68 L26.1
  Top 0.813: C46.1 arc90 81.78,14.68 80.95,14.68
N$11
  Top 0.406: L5.2 18.92,61.67 | L6.1 22.07,61.67
  Top 0.813: 18.92,61.67 19.75,61.67 C5.1 C8.1 21.3,61.67 22.07,61.67
N$12
  Top 0.406: L6.2 24.18,61.67
  Top 0.813: 24.18,61.67 26.13,61.67 C6.2
N$13
  Top 0.813: U8.3 C1.1
N$14
  Top 0.305: C65.1 42.8,49.71 | 43.41,49.71 43.76,49.71 D3.A
  Top 0.813: 42.8,49.71 43.41,49.71 | D3.A 45.08,49.73 D4.C C60.1 | C60.1
N$15
  Top 0.813: C61.2 70.91,49.73 arc-90 R10.2 arc-90 72.57,48.07 R9.1
N$16
  Top 0.813: R9.2 arc90 72.56,45.04 R11.2 72.56,35.38 arc90 C26.1
N$17
  Top 0.305: 32.51,57.63 L3.1
  Top 0.813: C17.1 32.51,57.63
N$18
  Top 0.254: L7.2 70.15,22.1 70.54,21.72 70.54,20.04 U2.3
  Top 0.813: L15.1 67.16,23.83 67.67,23.32 67.67,22.15 L7.2 | U2.3 arc90 72.67,21.82 C27.2
N$19
  Top 0.254: U3.3 68.45,65 70.31,65 70.66,65.35 L8.2
  Top 0.813: L20.1 72.72,65.99 72.36,65.63 71.12,65.63 L8.2 | U3.3 68.07,64.57 C16.2
N$20
  Top 0.254: U4.1 36.85,49.92 36.91,49.89
  Top 0.813: 36.91,49.89 36.49,50.32 C20.1
N$21
  Top 0.305: 32.51,55.7 L3.2 | 32.54,52.32 L4.1
  Top 0.813: 32.51,55.7 32.53,55.69 C18.1 C19.1 32.53,52.34 32.54,52.32
N$22
  Top 0.61: L4.2 33.19,50.73 33.2,50.72
  Top 0.813: 33.2,50.72 C20.2
N$23
  Top 0.254: 40.4,47.72 C64.1 | C64.1 40.6,47.25 R5.2 | U4.5 40.06,48.77 40.56,48.26 40.56,47.84 C64.1
N$24
  Top 0.305: 60.63,62.19 60.63,62.81
  Top 0.406: FLT2.5 60.63,62.19
  Top 0.813: 60.63,62.81 60.62,63.03 C15.1
N$25
  Top 0.813: FLT1.1 83.08,60.66 84.63,61.75 89.71,61.75 89.64,61.67 89.36,61.67 89.38,61.69 J2.RF
N$26
  Top 0.406: 72.64,25.35 72.67,25.37 L9.1
  Top 0.813: C27.1 72.64,24.34 72.64,25.35
N$27
  Top 0.305: 72.67,27.2 L9.2
  Top 0.406: 72.59,30.63 L10.1
  Top 0.813: 72.67,27.2 72.67,28.1 arc-90 C25.1 72.61,28.19 C28.1 72.59,29.71 72.59,30.63
N$28
  Top 0.406: 72.59,32.59 L10.2
  Top 0.813: C26.2 72.59,32.59
N$29
  Top 0.305: C71.1 13.58,20.93 D1.A 14.71,20.88 L31.2
  Top 0.813: C71.1 D1.A 15.91,20.78 C50.2
N$30
  Top 0.813: C85.2 27.73,10.95 R2.1
N$31
  Top 0.152: U5.2 105.03,17.89 105.26,18.11 108.86,18.11 109.6,18.85 109.6,34.14 110.01,34.54 110.01,38.71 109.8,38.91 109.17,38.91 109.09,38.99 109.09,41.07 108.99,41.17 108.99,41.23 R19.2
N$32
  Top 0.813: J3.RF 69.32,43.81 C29.1
N$33
  Top 0.61: R18.1 118.15,10.11 C52.1
N$34
  Top 0.152: C32.1 115.21,10.22 115.21,8.94 114.5,8.23 102.39,8.23 102.03,8.58 U5.15
  Top 0.61: L13.2 116.05,10.21 | 116.05,10.21 116.05,10.17 R18.2 | C32.1 116,10.26 116.05,10.21
N$35
  Top 0.406: R17.2 L13.1
N$36
  Top 0.152: U5.3 104.53,17.92 105.05,18.44 108.66,18.44 109.25,19.02 109.25,33.73 108.36,34.62 105.16,34.62 104.95,34.82 104.95,38.86 105.13,39.04 106.5,39.04 106.65,39.19 106.65,41.36 R24.2
N$37
  Top 0.152: U5.4 104.03,18.16 104.62,18.77 108.48,18.77 108.89,19.18 108.89,33.58 108.25,34.21 104.7,34.21 104.57,34.34 104.57,38.73 103.99,39.32 103.99,41.39 R25.2
N$38
  Top 0.152: U5.5 103.53,18.29 104.29,19.1 108.31,19.1 108.56,19.35 108.56,33.4 108.15,33.81 104.5,33.81 104.19,34.11 104.19,38.53 103.99,38.73 101.73,38.73 101.5,38.96 101.5,41.44 R26.2
N$39  (via drill 0.25 pad 0.25)
  Top 0.152: U5.6 103.03,18.76 v103.3,19.02 | v101.96,31.88 101.52,32.31 99.64,32.31 98.96,32.99 R27.2
  Bottom 0.152: v103.3,19.02 103.3,22.66 102.31,23.65 102.31,27.53 101.96,27.89 v101.96,31.88
N$40
  Top 0.254: U5.16 102.53,12.93 102.54,12.75 103.56,12.75 | 103.56,12.75 104.01,12.75 | 104.01,12.75 104.52,12.75 104.53,12.76 U5.20 | U5.19 104.03,12.77 104.01,12.75 | U5.18 103.53,12.77 103.56,12.75 | 103.56,12.75 C36.1
N$41
  Top 0.813: X1.3 100.8,27.37 102.13,29.64 105.21,29.64 105.51,28.22 105.51,28.39 R22.2 105.5,27.25 R20.2
N$42  (via drill 0.25 pad 0.25)
  Top 0.152: C33.1 v105.54,20.5 | U5.1 105.53,17.55 105.62,17.73 105.79,17.73 v106.02,17.53
  Route3 0.813: v105.54,20.5 105.56,19.1 105.56,17.98 v106.02,17.53
N$43
  Top 0.813: R20.1 105.54,24.37 R21.2 105.55,22.98 C33.2
N$44
  Top 0.254: U5.28 106.49,16.59 C37.1
N$45
  Top 0.254: U5.22 C38.1
N$46
  Top 0.152: U5.14 101.36,14.07 100.99,14.07 100.89,13.97 100.89,13.56 101.35,13.11 C39.1
N$47
  Top 0.152: U5.25 106.92,15.09 R23.1
N$48
  Top 0.254: U5.7 102.53,18.28 C48.1
N$49  (via drill 0.25 pad 0.25)
  Top 0.152: U5.9 101.36,16.61 100.94,16.61 100.74,16.81 v100.74,17.27 | v98.12,32.54 98.12,39.09 97.76,39.45 96.65,39.45 96.34,39.75 96.34,41.44 R28.2
  Bottom 0.152: v100.74,17.27 100.53,17.48 99.29,17.48 98.6,18.16 98.6,24.64 98.12,25.12 v98.12,32.54
N$50
  Top 0.61: L16.2 27.63,68.77 C53.1 28.87,68.76 R16.2
N$51
  Top 0.152: U5.26 106.51,15.59 106.65,15.44 111.68,15.44 111.73,15.39 C31.1
  Top 0.406: C31.1 R17.1
N$52
  Top 0.152: R6.1 126.31,45.31 126.72,44.91 126.72,37.59 126.9,37.41 129.15,37.41 U7.21
N$53
  Top 0.152: R8.1 126.06,44.09 126.24,43.92 126.24,37.16 126.52,36.88 129.17,36.88 U7.22
N$54
  Top 0.152: R7.1 125.2,42.85 125.73,42.32 125.73,36.65 126.01,36.37 129.16,36.37 U7.23
N$55
  Top 0.152: R4.1 126.92,46.61 127.23,46.3 127.23,38.07 127.41,37.9 U7.20
N$56
  Top 0.152: BAL1.1 90.78,14.63 90.55,14.63
  Top 0.813: 90.55,14.63 89.69,14.63 C51.2
N$57
  Top 0.254: R29.2 JP1.10
N$59
  Top 0.813: C34.2 92.38,27.36 92.53,27.51 92.53,27.38 L19.2 95.56,27.36 95.66,27.46 95.66,27.41 X1.4 95.72,29.21 C35.1
N$60
  Top 0.61: L27.3 36.13,26 C73.2 C72.2 C74.1 36.13,31.7 C83.1 35,31.75 L28.2
N$61
  Top 0.813: C61.1 U8.2
N$62
  Top 0.813: U4.6 39.66,49.71 C65.2
N$63
  Top 0.254: L27.1 33.12,23.22 33.12,21.01
  Top 0.406: 35.56,20.98 35.67,20.98 L24.1
  Top 0.813: U6.3 31.29,21.01 33.12,21.01 34.43,21.01 C13.1 35.55,20.99 35.56,20.98
N$64
  Top 0.152: U7.6 136.18,44.54 135.66,45.06 135.13,45.06 134.82,44.75 134.82,44.34 X2.1
  Top 0.406: C67.1 133.42,43.98 X2.1
N$65
  Top 0.152: U7.5 136.68,44.69 X2.3
  Top 0.406: C66.1 139.35,46.18 X2.3
N$66
  Top 0.152: U7.45 137.18,26.91 137.39,26.7 139.19,26.7 139.65,26.24 R42.1
N$67
  Top 0.152: U7.44 136.68,26.49 136.86,26.31 138.53,26.31 138.71,26.14 138.71,25.72 R43.1
N$68
  Top 0.152: U7.47 138.18,28.87 C69.1
N$69
  Top 0.813: R2.2 26.09,13.82 26.09,15.8 L21.1
N$70
  Top 0.254: L21.2 26.19,20.76 26.26,20.84
  Top 0.305: 22.58,20.85 22.37,20.85 L23.2
  Top 0.813: C80.1 22.59,20.84 22.58,20.85 | C80.1 23.79,20.85 | 28.22,20.93 U6.1 28.13,20.84 26.26,20.84 C80.1
N$71
  Top 0.813: J4.RF 6.73,20.83 L22.2 11.74,20.78 11.53,20.8 11.65,20.8 C71.2
N$72
  Top 0.406: 78.99,14.63 79.28,14.63 L26.2 | 75.97,14.63 L29.1
  Top 0.813: 78.99,14.63 78.98,14.64 C24.1 C49.1 75.98,14.64 75.97,14.63
N$73
  Top 0.152: U7.31 128.42,32.39 127.94,32.87 C68.1
N$74
  Top 0.406: 37.26,21.08 37.17,21.08 L24.2
  Top 0.813: 37.26,21.08 37.28,21.07 C14.1 40.28,22.97 40.28,40.79 C62.2
N$75
  Top 0.254: R38.2 147.5,39.85 JP2.6
N$76
  Top 0.254: R39.2 JP2.5
N$77
  Top 0.254: R40.2 147.47,34.95 JP2.4
N$78
  Top 0.254: R41.2 147.4,29.59 JP2.2
N$79
  Top 0.152: R1.1 128.07,49.15 128.3,48.92 128.3,43 128.45,42.85 131.04,42.85 131.17,42.72 131.17,41.4 U7.16
N$80
  Top 0.152: R12.1 127.51,47.88 127.79,47.6 127.79,42.57 128.07,42.29 129.9,42.29 129.95,42.24 129.95,39.52 129.81,39.39 U7.17 129.16,39.37
N$81
  Top 0.813: C60.2 54.41,49.71 54.46,49.76 54.58,49.76 U8.1
N$83
  Top 0.406: 74.14,14.63 L29.2
  Top 0.813: C45.2 74.14,14.63
N$84
  Top 0.61: R16.1 34.89,67.2 C3.2 | C3.2 C2.2 C4.1 40.49,65.39 L14.3 | C3.2 35.26,67.07 L1.1
N$85
  Top 0.813: U2.1 70.84,16.87 70.94,16.76 70.94,14.64 C45.1
N$86
  Top 0.305: 20.62,20.83 L23.1
  Top 0.813: C50.1 17.73,20.84 C77.1 20.61,20.84 20.62,20.83
N$87  (via drill 0.25 pad 0.25)
  Top 0.152: R15.1 125.04,41.55 125.27,41.33 125.27,28.7 v125.78,28.19 | U7.41 135.2,29.86 135.2,28.35 v135.26,28.3
  Route2 0.152: v125.78,28.19 135.15,28.19 v135.26,28.3
N$91  (via drill 0.25)
  Top 0.254: U11.4 22.25,47.45 21.97,47.73 13.28,47.73 v12.83,48.18 | R13.1 12.85,67.5 v12.85,66.34
  Bottom 0.254: v12.83,48.18 12.83,66.32 v12.85,66.34
N$92  (via drill 0.25)
  Top 0.254: U11.2 19.71,46.76 19.56,46.91 16.41,46.91 v15.82,46.33 | v15.82,29.84 16.08,29.54 16.43,29.18 16.43,28.11 R14.1
  Bottom 0.254: v15.82,46.33 v15.82,29.84
N$93  (via drill 0.25)
  Top 0.254: U11.3 20.98,46.58 v21.06,46.66 | v24.89,46.58 24.89,45.06 U11.6
  Route2 0.254: v21.06,46.66 24.82,46.66 v24.89,46.58
N$999
  Top 0.152: C10.2 arc-90 62.92,23.99 62.92,23.06 | C12.1 arc90 62.92,25.82 62.92,26.67 | C11.2 arc-90 63.42,22.19 63.61,22.19
  Top 0.813: L7.1 63.7,22.1 63.61,22.19 62.92,22.89 62.92,23.06 62.92,26.67 62.92,26.8 63.63,27.51 64.57,27.51 L15.3 64.62,29.17 C90.1 63.34,29.25 L25.2
NRST  (via drill 0.25 pad 0.25)
  Top 0.152: R39.1 142.93,37.39 v142.9,37.36 | v135.76,37.34 135.76,37.41 135.66,37.52 135.66,41.37 U7.7 135.66,42.09 135.53,42.21 v135.53,42.44 | v129.36,44.73 R37.1 130.09,45.6 C63.1
  Route2 0.152: v142.9,37.36 135.79,37.36 v135.76,37.34 | v135.53,42.44 135.53,42.54 135.69,42.7 135.69,44.3 135.26,44.73 v129.36,44.73
SWCLK
  Top 0.152: U7.49 144.11,31.89 144.25,31.75 144.25,29.65 R41.1
SWDIO  (via drill 0.25 pad 0.25)
  Top 0.152: R40.1 144.36,34.3 v144.25,34.19 | 137.69,29.9 U7.46 137.67,29.9 137.67,30.99 137.82,31.14 v143.59,31.14
  Route2 0.152: v144.25,34.19 144.25,31.9 v143.59,31.14
SWO  (via drill 0.25 pad 0.25)
  Top 0.152: R38.1 143.69,39.85 v143.51,39.67 | v143.48,34.9 U7.55
  Route2 0.152: v143.51,39.67 143.51,34.92 v143.48,34.9
SYNTH_CS  (via drill 0.25 pad 0.25)
  Top 0.152: R4.2 118.67,46.61 v118.34,46.94 | v107.8,48.64 107.8,42.9 107.62,42.72 106.67,42.72 R24.1
  Top 0.254: R24.1 106.63,45.82 JP1.5
  Route2 0.152: v118.34,46.94 118.34,48.06 117.86,48.54 107.9,48.54 v107.8,48.64
SYNTH_N
  Top 0.152: L11.1 99.38,16.88 C96.1 99.64,15.85 arc-90 99.87,15.62 99.87,15.48 100.81,15.48 arc-90 100.92,15.59 U5.11
SYNTH_OUT
  Top 0.813: C51.1 83.58,14.68 C46.2
SYNTH_P
  Top 0.152: 99.56,15.09 arc90 C95.1 | L12.1 99.36,13.72 C95.1 | U5.12 100.92,15.09 arc-90 100.81,15.2 99.87,15.2 99.87,15.09 arc-90 99.67,14.88 C95.1
SYNTH_SCLK  (via drill 0.25 pad 0.25)
  Top 0.152: R6.2 119.3,45.31 v119.23,45.39 | v103.96,49.53 103.96,45.95 JP1.6
  Top 0.254: R25.1 JP1.6
  Route2 0.152: v119.23,45.39 119.23,49.76 119.05,49.94 104.37,49.94 v103.96,49.53
SYNTH_SDI  (via drill 0.25 pad 0.25)
  Top 0.152: R7.2 110.79,42.85 v110.77,42.88 | v102.39,42.88 101.59,42.88 R26.1
  Top 0.254: R26.1 JP1.7
  Route2 0.152: v110.77,42.88 v102.39,42.88
SYNTH_SDO  (via drill 0.25 pad 0.25)
  Top 0.152: R8.2 120.29,44.09 v120.19,44.2 | v98.93,50.32 98.93,46.08 98.96,46.05 98.96,45.8
  Top 0.254: R27.1 98.96,45.8 98.96,45.87 JP1.8
  Route2 0.152: v120.19,44.2 120.19,50.16 119.86,50.5 99.11,50.5 v98.93,50.32
SYNTH_STAT
  Top 0.152: R1.2 109.58,49.15 109.14,48.72 109.14,46.23 109.02,46.1 109.07,46.1 109.14,46.02
  Top 0.254: R19.1 109.07,45.95 109.14,46.02 109.14,45.95 JP1.4
UHF_ACTIVE
  Top 0.406: R14.2 14.72,26.28 14.71,26.26 L31.1
UHF_IN
  Top 0.813: C7.2 7.01,61.65 6.68,61.32 L2.1 6.27,61.37 J1.RF
VHF_ACTIVE
  Top 0.61: R13.2 16.31,67.61 L30.1
VIN_5V
  Top 0.61: J5.1 139.62,17.37 138.99,16.74 138.99,15.25 FB14.P$2

## Text on the board
tPlace: 914.5 MHz | IF | UHF | ANT_SW | DFU Boot | !MUTE | SCLK | LOCK | SDO | SDI | GND | 3V3 | +5V | !CS | TP | TP | GIO0 | 3V3 | GIO6 | GIO4 | GIO2 | GIO1 | GND | GIO7 | GIO5 | GIO3 | HF/VHF